# EAGLE design hot_er_lutownica (EAGLE 8.7.0)
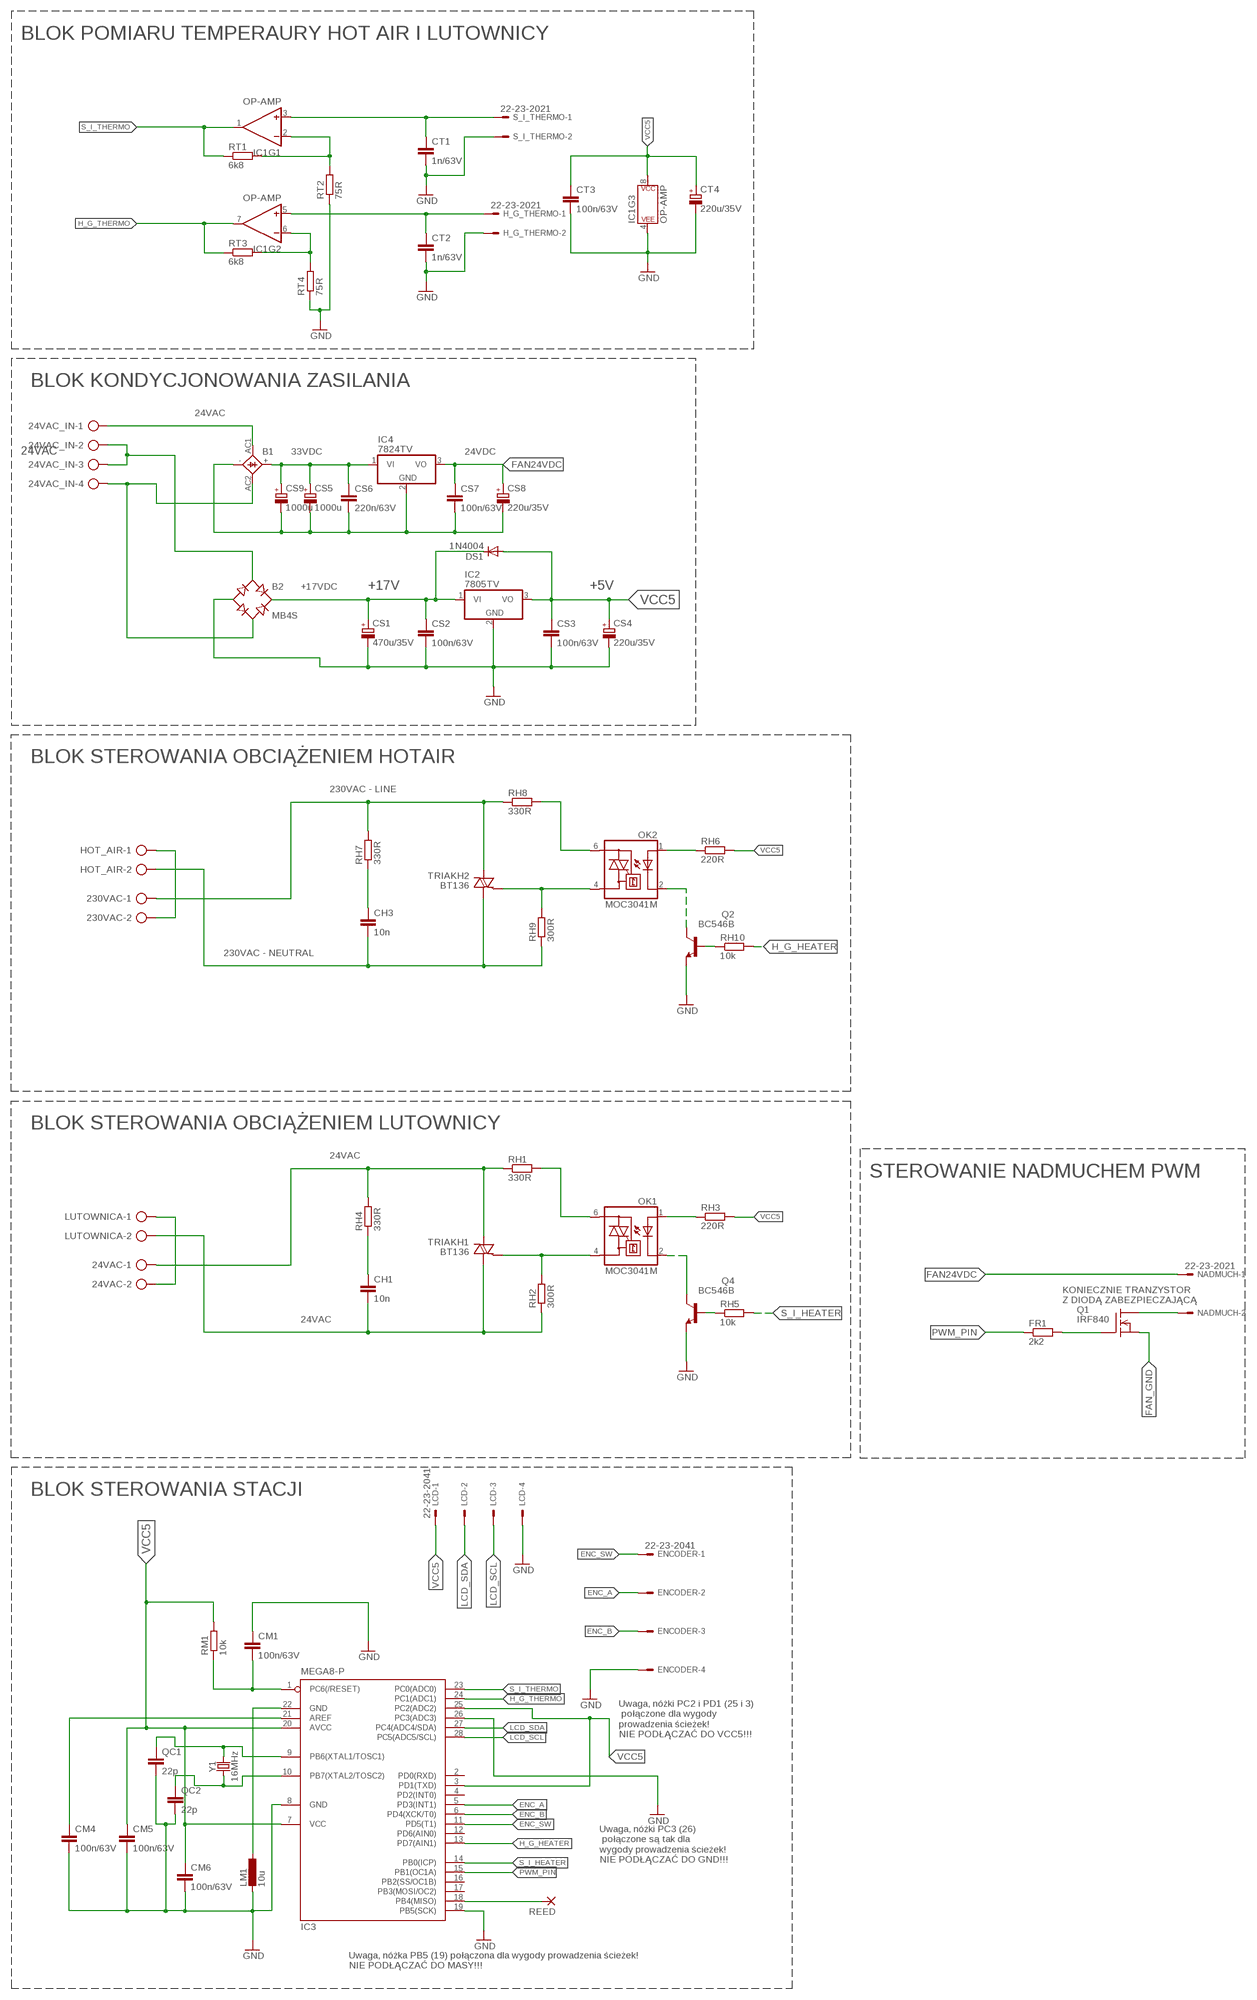
[diagram p0: schematic, sheet 1]

## Parts
24VAC  AK500/2  [AK500/2]
24VAC_IN  AK500/4  [AK500/4]
230VAC  AK500/2  [AK500/2]
B1  2KBB-R  [2KBB-R]
B2  MB4S  [SOIC-4]
CH1  10n  C-EU102-043X133  [C102-043X133]
CH3  10n  C-EU102-043X133  [C102-043X133]
CM1  100n/63V  C-EU050-024X044  [C050-024X044]
CM4  100n/63V  C-EU050-024X044  [C050-024X044]
CM5  100n/63V  C-EU050-024X044  [C050-024X044]
CM6  100n/63V  C-EU050-024X044  [C050-024X044]
CS1  470u/35V  CPOL-EUB45181A  [B45181A]
CS2  100n/63V  C-EU050-024X044  [C050-024X044]
CS3  100n/63V  C-EU050-024X044  [C050-024X044]
CS4  220u/35V  CPOL-EUB45181A  [B45181A]
CS5  1000u  CPOL-EUE3.5-8  [E3,5-8]
CS6  220n/63V  C-EU050-024X044  [C050-024X044]
CS7  100n/63V  C-EU050-024X044  [C050-024X044]
CS8  220u/35V  CPOL-EUB45181A  [B45181A]
CS9  1000u  CPOL-EUE3.5-8  [E3,5-8]
CT1  1n/63V  C-EU050-024X044  [C050-024X044]
CT2  1n/63V  C-EU050-024X044  [C050-024X044]
CT3  100n/63V  C-EU050-024X044  [C050-024X044]
CT4  220u/35V  CPOL-EUB45181B  [B45181B]
DS1  1N4004  [DO41-10]
ENCODER  22-23-2041  [22-23-2041]
FR1  2k2  R-EU_R0805  [R0805]
H_G_THERMO  22-23-2021  [22-23-2021]
HOT_AIR  AK500/2  [AK500/2]
IC1  OP-AMP  OPAMP-DUALDIP  [DIP08]
IC2  7805TV  [TO220V]
IC3  MEGA8-P  [DIL28-3]
IC4  7824TV  [TO220V]
LCD  22-23-2041  [22-23-2041]
LM1  10u  L-EU0207/10  [0207/10]
LUTOWNICA  AK500/2  [AK500/2]
NADMUCH  22-23-2021  [22-23-2021]
OK1  MOC3041M  [DIL06]
OK2  MOC3041M  [DIL06]
Q1  IRF840  [TO220]
Q2  BC546B  [TO92-EBC]
Q4  BC546B  [TO92-EBC]
QC1  22p  C-EUC0805K  [C0805K]
QC2  22p  C-EUC0805K  [C0805K]
REED  2,54/0,9  [2,54/0,9]
RH1  330R  R-EU_0204/7  [0204/7]
RH2  300R  R-EU_0204/5  [0204/5]
RH3  220R  R-EU_0204/5  [0204/5]
RH4  330R  R-EU_0204/5  [0204/5]
RH5  10k  R-EU_0204/7  [0204/7]
RH6  220R  R-EU_0204/7  [0204/7]
RH7  330R  R-EU_0204/7  [0204/7]
RH8  330R  R-EU_0207/10  [0207/10]
RH9  300R  R-EU_0204/5  [0204/5]
RH10  10k  R-EU_0207/12  [0207/12]
RM1  10k  R-EU_R0805  [R0805]
RT1  6k8  R-EU_0207/2V  [0207/2V]
RT2  75R  R-EU_0207/2V  [0207/2V]
RT3  6k8  R-EU_0207/2V  [0207/2V]
RT4  75R  R-EU_0207/2V  [0207/2V]
S_I_THERMO  22-23-2021  [22-23-2021]
TRIAKH1  BT136  [TO220AB]
TRIAKH2  BT136  [TO220AB]
Y1  16MHz  CRYSTALPTH-HC49UV  [HC49U]

## Nets
230NEUTRAL: 230VAC.2 HOT_AIR.1
AGND: IC3.22(GND) LM1.1
COSZEBYBYLODLUGIE: CH3.1 RH7.1
ENC_A: ENCODER.2 IC3.5(PD3(INT1))
ENC_B: ENCODER.3 IC3.6(PD4(XCK/T0))
ENC_SW: ENCODER.1 IC3.11(PD5(T1))
FAN24VDC: CS7.1 CS8.+ IC4.3(VO) NADMUCH.1
FAN_GND: B1.- CS5.- CS6.2 CS7.2 CS8.- CS9.- IC4.2(GND) Q1.3(S)
GATEHOT: OK2.4(A1) RH9.2 TRIAKH2.3(G)
GATELUT: OK1.4(A1) RH2.2 TRIAKH1.3(G)
GND: B2.- CM1.1 CM4.2 CM5.2 CM6.2 CS1.- CS2.2 CS3.2 CS4.- CT1.2 CT2.2 CT3.2 CT4.- ENCODER.4 H_G_THERMO.2 IC1.4(P$V-) IC2.2(GND) IC3.8(GND) IC3.19(PB5(SCK)) IC3.26(PC3(ADC3)) LCD.4 LM1.2 Q2.E Q4.E QC1.2 QC2.2 RT2.1 RT4.1 S_I_THERMO.2
H_G_HEATER: IC3.13(PD7(AIN1)) RH10.2
H_G_THERMO: IC1.7(OUT) IC3.24(PC1(ADC1)) RT3.1
HEATER_L: CH1.2 LUTOWNICA.2 RH2.1 TRIAKH1.1(A1)
HEATER_L1: CH3.2 HOT_AIR.2 RH9.1 TRIAKH2.1(A1)
HG_THERMO: CT2.1 H_G_THERMO.1 IC1.5(+IN)
LCD_SCL: IC3.28(PC5(ADC5/SCL)) LCD.3
LCD_SDA: IC3.27(PC4(ADC4/SDA)) LCD.2
MAIN_L: 24VAC.1 RH1.1 RH4.2 TRIAKH1.2(A2)
MAIN_L1: 230VAC.1 RH7.2 RH8.1 TRIAKH2.2(A2)
MAIN_N: 24VAC.2 LUTOWNICA.1
N$1: IC3.9(PB6(XTAL1/TOSC1)) QC1.1 Y1.2
N$2: IC3.10(PB7(XTAL2/TOSC2)) QC2.1 Y1.1
N$3: OK1.1(A) RH3.1
N$4: OK2.6(A2) RH8.2
N$7: OK2.1(A) RH6.1
N$8: IC1.6(-IN) RT3.2 RT4.2
N$9: NADMUCH.2 Q1.2(D)
N$10: IC1.2(-IN) RT1.2 RT2.2
N$11: 24VAC_IN.1 B1.AC1
N$12: FR1.2 Q1.1(G)
N$13: OK2.2(C) Q2.C
N$15: OK1.6(A2) RH1.2
N$17: Q2.B RH10.1
N$18: 24VAC_IN.2 24VAC_IN.3 B2.~1(AC1)
N$19: 24VAC_IN.4 B1.AC2 B2.~2(AC2)
N$21: OK1.2(C) Q4.C
N$22: Q4.B RH5.1
N$23: CH1.1 RH4.1
POS17V: B2.+ CS1.+ CS2.1 DS1.C IC2.1(VI)
POS33V: B1.+ CS5.+ CS6.1 CS9.+ IC4.1(VI)
PWM_PIN: FR1.1 IC3.15(PB1(OC1A))
REED: IC3.18(PB4(MISO)) REED.1(P)
REFERENCE: CM4.1 IC3.21(AREF)
RESET: CM1.2 IC3.1(PC6(/RESET)) RM1.1
S_I_HEATER: IC3.14(PB0(ICP)) RH5.2
S_I_THERMO: IC1.1(OUT) IC3.23(PC0(ADC0)) RT1.1
SI_THERMO: CT1.1 IC1.3(+IN) S_I_THERMO.1
VCC5: CM5.1 CM6.1 CS3.1 CS4.+ CT3.1 CT4.+ DS1.A IC1.8(P$V+) IC2.3(VO) IC3.3(PD1(TXD)) IC3.7(VCC) IC3.20(AVCC) IC3.25(PC2(ADC2)) LCD.1 RH3.2 RH6.2 RM1.2
Unconnected: IC3.2(PD0(RXD)) IC3.4(PD2(INT0)) IC3.12(PD6(AIN0)) IC3.16(PB2(SS/OC1B)) IC3.17(PB3(MOSI/OC2))

## Notes on the sheet
- BLOK POMIARU TEMPERAURY HOT AIR I LUTOWNICY
- BLOK KONDYCJONOWANIA ZASILANIA
- 24VAC
- 24VAC | 33VDC | 24VDC
- +17VDC | +17V | +5V
- BLOK STEROWANIA OBCIĄŻENIEM HOTAIR
- 230VAC - LINE
- 230VAC - NEUTRAL
- BLOK STEROWANIA OBCIĄŻENIEM LUTOWNICY
- 24VAC
- STEROWANIE NADMUCHEM PWM
- KONIECZNIE TRANZYSTOR
  Z DIODĄ ZABEZPIECZAJĄCĄ
- 24VAC
- BLOK STEROWANIA STACJI
- Uwaga, nóżki PC2 i PD1 (25 i 3)
   połączone dla wygody 
  prowadzenia ścieżek! 
  NIE PODŁĄCZAĆ DO VCC5!!!
- Uwaga, nóżki PC3 (26)
   połączone są tak dla 
  wygody prowadzenia ścieżek! 
  NIE PODŁĄCZAĆ DO GND!!!
- Uwaga, nóżka PB5 (19) połączona dla wygody prowadzenia ścieżek! 
  NIE PODŁĄCZAĆ DO MASY!!!

## Library data of the parts
24VAC 230VAC HOT_AIR LUTOWNICA = con-ptr500:AK500/2: CONNECTOR; OC_FARNELL: unknown; OC_NEWARK: unknown
24VAC_IN = con-ptr500:AK500/4: CONNECTOR; OC_FARNELL: unknown; OC_NEWARK: unknown
B1 = rectifier:2KBB-R: RECTIFIER grid 3 x 5 mm
B2 = rectifier:MB*S: Bridge Rectifier Source: http://www.fairchildsemi.com/ds/MB/MB6S.pdf
CH1 CH3 CM1 CM4-CM6 CS2 CS3 CS6 CS7 CT1-CT3 QC1 QC2 = rcl:C-EU: CAPACITOR, European symbol; SPICEPREFIX: C
CS1 CS4 CS5 CS8 CS9 CT4 = rcl:CPOL-EU: POLARIZED CAPACITOR, European symbol; SPICEPREFIX: C
DS1 = diode:1N4004: DIODE general purpose rectifier, 1 A
ENCODER LCD = con-molex:22-23-2041: .100" (2.54mm) Center Header - 4 Pin; MF: MOLEX; MPN: 22-23-2041; OC_FARNELL: 1462920; OC_NEWARK: 38C0355
FR1 RH1-RH10 RM1 RT1-RT4 = rcl:R-EU_: RESISTOR, European symbol; SPICEPREFIX: R
H_G_THERMO NADMUCH S_I_THERMO = con-molex:22-23-2021: .100" (2.54mm) Center Header - 2 Pin; MF: MOLEX; MPN: 22-23-2021; OC_FARNELL: 1462926; OC_NEWARK: 25C3832
IC1 = SparkFun-IC-Amplifiers:OPAMP-DUAL: Generic op-amp footprint This component is for the standard 358 pinning of a dual op-amp From the LM358 datasheet: Pin 1: Output A Pin 2: Inverting Input A Pin 3: Non-Inverting Input A Pin 4: Gnd Pin 5: Non-Inverting Input B Pin 6: Inverting Input B Pin 7: Output B Pin 8: V+; PROD_ID: NA-XXXXX
IC2 IC4 = linear:78*: Positive VOLTAGE REGULATOR Source: http://cache.national.com/ds/LM/LM78L05.pdf http://www.fairchildsemi.com/ds/LM/LM7805.pdf
IC3 = atmel:MEGA8-P: MICROCONTROLLER 8 Kbytes FLASH, 1 kbytes SRAM, 512 bytes EEPROM, USART, 4-channel 10 bit ADC, 2-channel 8 bit ADC Pin compatible with Atmega48, ATMega88, ATMega168 Source: avr.lbr; OC_FARNELL: unknown; OC_NEWARK: unknown
LM1 = rcl:L-EU: INDUCTOR, European symbol; SPICEPREFIX: L
OK1 OK2 = optocoupler:MOC30*: 6-Pin DIP Zero-Cross Optoisolators Triac Driver Output (250/400 Volt Peak) Source: Data sheet <http://www.fairchildsemi.com/ds/MO/MOC3031M.pdf> The old path of data sheet not more available 2013-05-06.; MF: FAIRCHILD SEMICONDUCTOR; MPN: MOC3041M; OC_FARNELL: 1086677; OC_NEWARK: 78K6090
Q1 = transistor-fet:IRF840: N-Channel Enhancement MOSFET (HEXFET); 500V; 8A; 0,85Ohm
Q2 Q4 = transistor-npn:BC546*: NPN Transistor
REED = wirepad:2,54/0,9: THROUGH-HOLE PAD
TRIAKH1 TRIAKH2 = triac:BT136: Triac BT136 series E sensitive gate Source: http://www.nxp.com/acrobat_download/datasheets/BT136_SERIES_E_2.pdf
Y1 = SparkFun-Clocks:CRYSTAL: Crystals (Generic) These are passive quartz crystals, which can be used as a clock source for a microcontroller. Crystal's are two-terminal devices. They require external "load" capacitors to generate an oscillating signal.

## Board
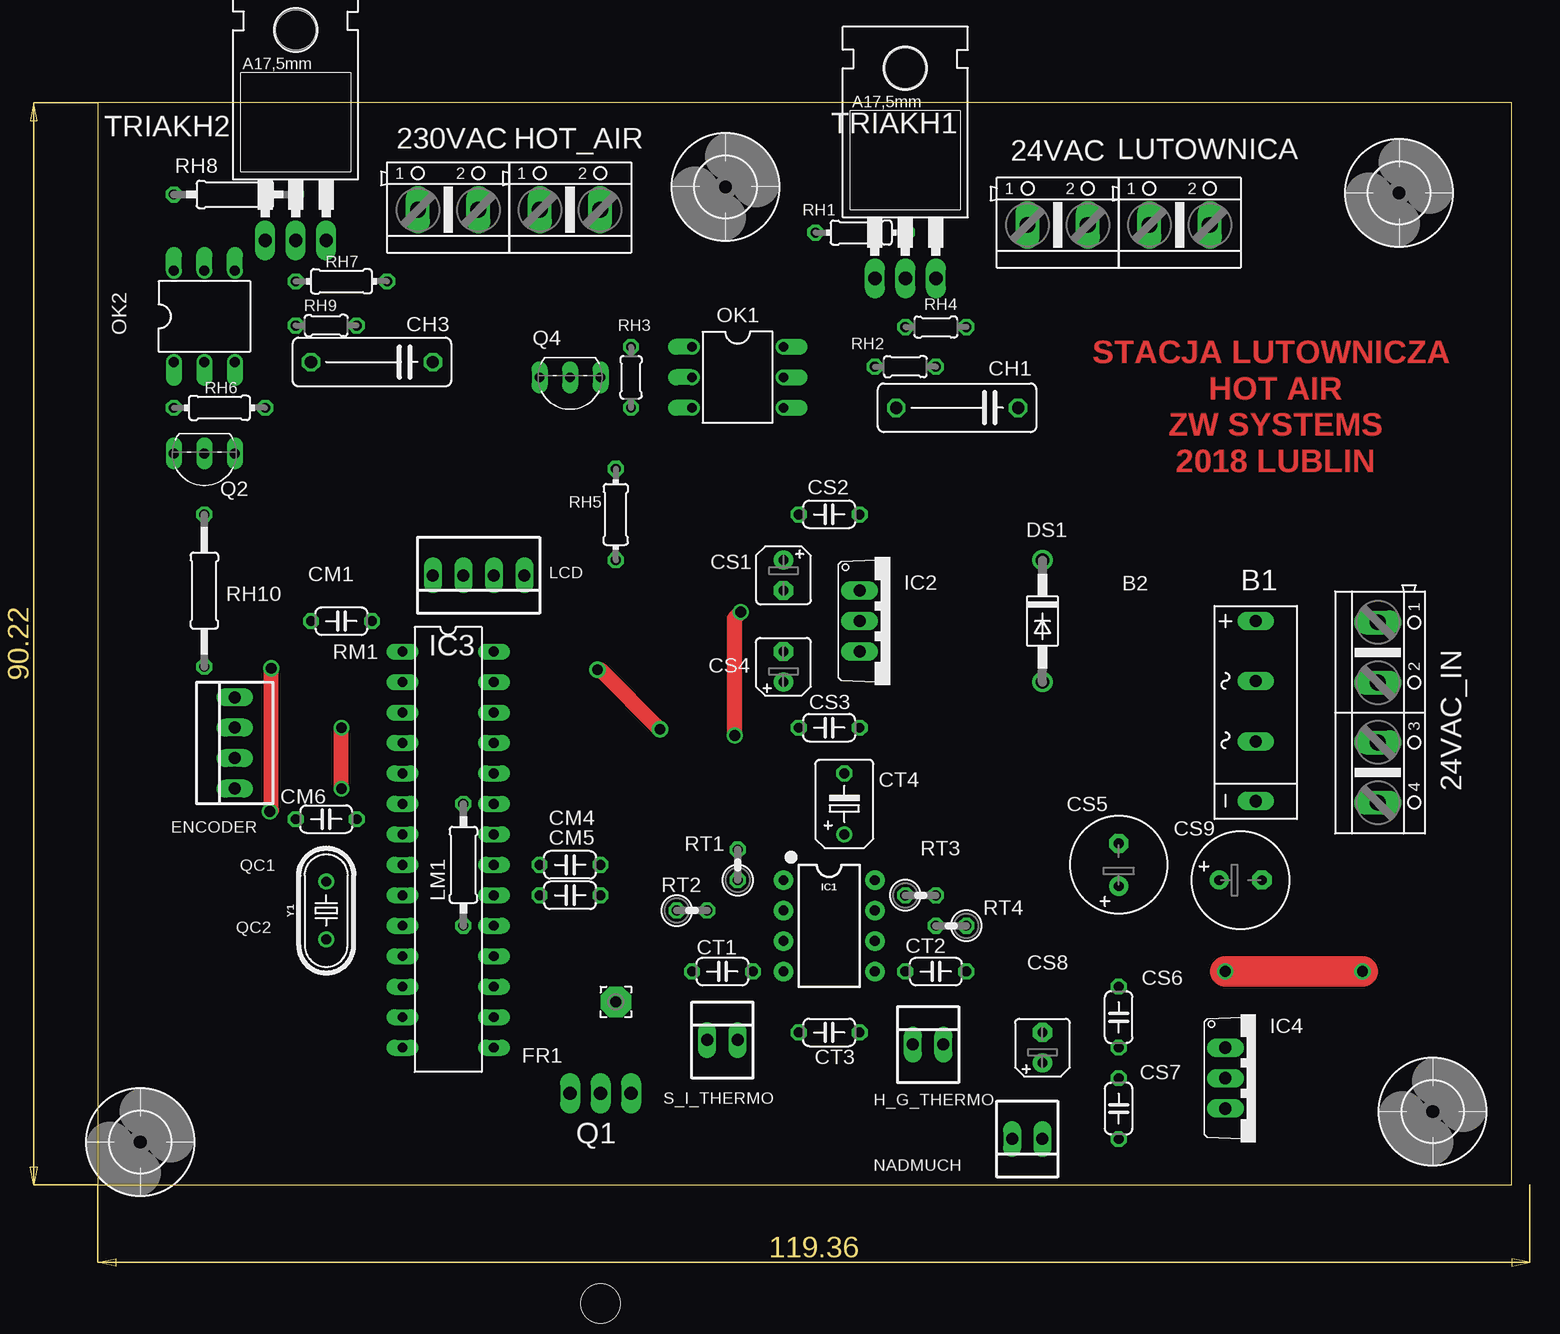
[diagram p1: board, top side]
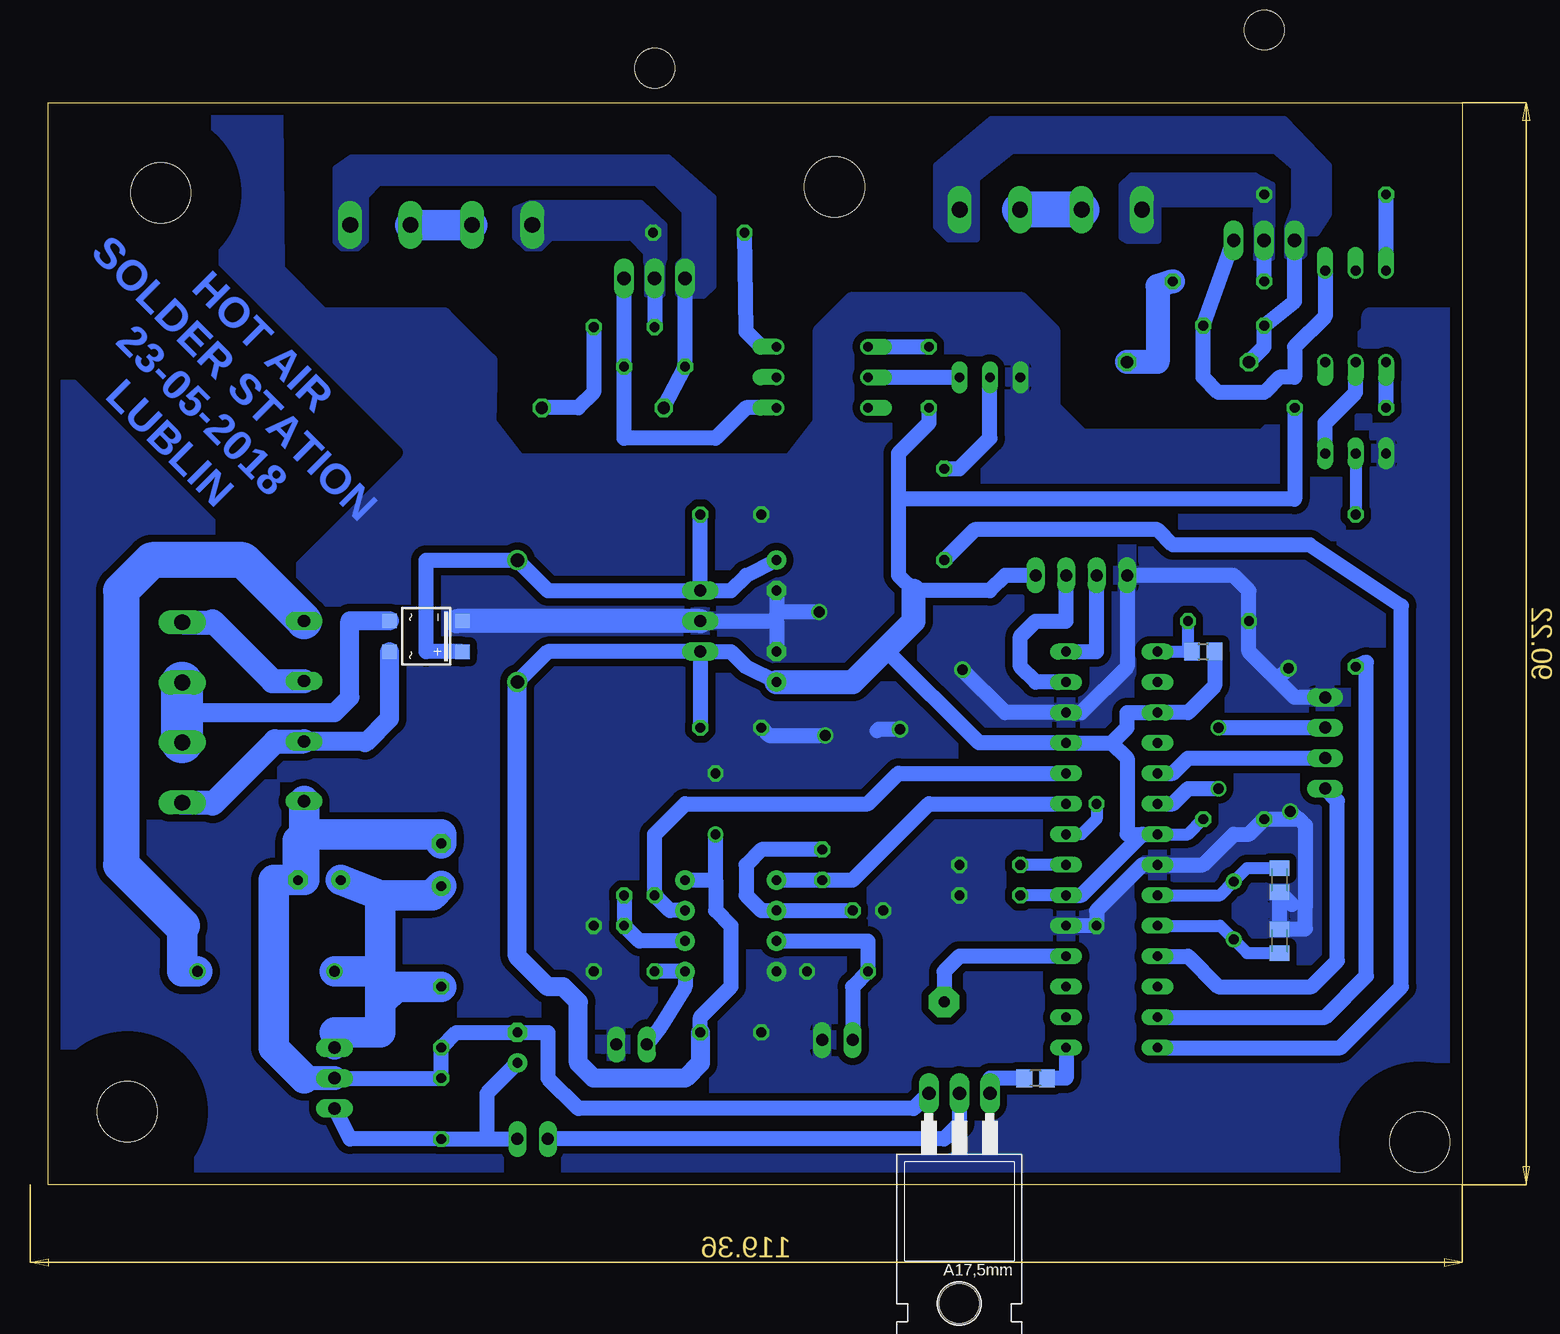
[diagram p2: board, bottom side, seen from below]

Size 117.84 x 90.22 mm. Coordinates in mm from the lower left corner, seen from the top.
Outline: 0,0 117.84,0 117.84,90.22 0,90.22 0,0
Copper layers (1*16): Top 0.035mm / dielectric 1.5mm / Bottom 0.035mm
Design rules "default": minimum track width 6mil, minimum drill 0.35mm, track to track 6mil, track to pad 6mil, pad to pad 6mil, via to via 6mil, smd to smd 6mil, copper to edge 40mil, drill to drill 6mil, minimum pad ring 10mil, minimum via ring 8mil, stop-mask expansion 4mil, vias tented up to drill 0mil, thermal gap 10mil

### Footprints (pad centres in the part's own frame; a part is rotated, then mirrored left to right if it is on the bottom)
AK500/2 = drill 1.321 long: 1 -2.515,0; 2 2.515,0
AK500/4 = drill 1.321 long: 1 -7.518,0; 2 -2.489,0; 3 2.489,0; 4 7.518,0
2KBB-R = drill 1.016 long: + -7.62,0; - 7.391,0; AC1 -2.616,0; AC2 2.413,0
SOIC-4 = smd 1.2 x 1.2: + 1.3,3.05; - -1.3,3.05; ~1 -1.3,-3.05; ~2 1.3,-3.05
C102-043X133 = drill 1.016 octagon: 1 -5.08,0; 2 5.08,0
C050-024X044 = drill 0.813 octagon: 1 -2.54,0; 2 2.54,0
B45181A = drill 0.813 pad 1.6: + -1.27,0 | drill 0.813 pad 1.6 octagon: - 1.27,0
E3,5-8 = drill 0.813 pad 1.6: + -1.778,0 | drill 0.813 pad 1.6 octagon: - 1.778,0
B45181B = drill 0.813: + -2.54,0 | drill 0.813 octagon: - 2.54,0
DO41-10 = drill 1.118: A 5.08,0; C -5.08,0
22-23-2041 = drill 1 long: 1 -3.81,0; 2 -1.27,0; 3 1.27,0; 4 3.81,0
R0805 = smd 1.3 x 1.5: 1 -0.95,0; 2 0.95,0
22-23-2021 = drill 1 long: 1 -1.27,0; 2 1.27,0
DIP08 = drill 0.813 pad 1.626: 1 -3.81,-3.81; 2 -1.27,-3.81; 3 1.27,-3.81; 4 3.81,-3.81; 5 3.81,3.81; 6 1.27,3.81; 7 -1.27,3.81; 8 -3.81,3.81
TO220V = drill 1.016 long: 1 -2.54,-2.54; 2 0,-2.54; 3 2.54,-2.54
DIL28-3 = drill 0.813 long: 1 -16.51,-3.81; 2 -13.97,-3.81; 3 -11.43,-3.81; 4 -8.89,-3.81; 5 -6.35,-3.81; 6 -3.81,-3.81; 7 -1.27,-3.81; 8 1.27,-3.81; 9 3.81,-3.81; 10 6.35,-3.81; 11 8.89,-3.81; 12 11.43,-3.81; 13 13.97,-3.81; 14 16.51,-3.81; 15 16.51,3.81; 16 13.97,3.81; 17 11.43,3.81; 18 8.89,3.81; 19 6.35,3.81; 20 3.81,3.81; 21 1.27,3.81; 22 -1.27,3.81; 23 -3.81,3.81; 24 -6.35,3.81; 25 -8.89,3.81; 26 -11.43,3.81; 27 -13.97,3.81; 28 -16.51,3.81
0207/10 = drill 0.813 octagon: 1 -5.08,0; 2 5.08,0
DIL06 = drill 0.813 offset: 1 -2.54,-3.81; 2 0,-3.81; 3 2.54,-3.81; 4 2.54,3.81; 5 0,3.81; 6 -2.54,3.81
TO220 = drill 1.118 long: 1 -2.54,-6.35; 2 0,-6.35; 3 2.54,-6.35 | hole 3.302: 0,11.176
TO92-EBC = drill 0.813 long: B 0,-1.27; C -2.54,-1.27; E 2.54,-1.27
C0805K = smd 1.3 x 1.6: 1 -1,0; 2 1,0
2,54/0,9 = drill 0.914 pad 2.54 octagon: 1 0,0
0204/7 = drill 0.813 octagon: 1 -3.81,0; 2 3.81,0
0204/5 = drill 0.813 octagon: 1 -2.54,0; 2 2.54,0
0207/12 = drill 0.813 octagon: 1 -6.35,0; 2 6.35,0
0207/2V = drill 0.813 octagon: 1 -1.27,0; 2 1.27,0
TO220AB = drill 1.118 long: 1 -2.54,-6.35; 2 0,-6.35; 3 2.54,-6.35 | hole 3.302: 0,11.176
5,0 = hole 5: 0,0
HC49U = drill 0.813: 1 -2.413,0; 2 2.413,0

### Placement (x,y rotation side)
24VAC  80.01,80.01 0 top
24VAC_IN  106.68,39.37 270 top
230VAC  29.21,81.28 0 top
B1  96.52,39.37 270 top
B2  86.36,45.72 270 bottom
CH1  71.63,64.77 180 top
CH3  22.86,68.58 180 top
CM1  20.32,46.99 0 top
CM4  39.37,26.67 0 top
CM5  39.37,24.13 0 top
CM6  19.05,30.48 180 top
CS1  57.15,50.8 270 top
CS2  60.96,55.88 180 top
CS3  60.96,38.1 180 top
CS4  57.15,43.18 90 top
CS5  85.09,26.67 90 top
CS6  85.09,13.97 270 top
CS7  85.09,6.35 90 top
CS8  78.74,11.43 90 top
CS9  95.25,25.4 0 top
CT1  52.07,17.78 0 top
CT2  69.85,17.78 0 top
CT3  60.96,12.7 180 top
CT4  62.23,31.75 90 top
DS1  78.74,46.99 270 top
ENCODER  11.43,36.83 90 top
FR1  35.56,8.89 180 bottom
H_G_THERMO  69.22,11.68 0 top
HOT_AIR  39.37,81.28 0 top
IC1  60.96,21.59 270 top
IC2  66.04,46.99 270 top
IC3  29.21,27.94 270 top
IC4  96.52,8.89 270 top
LCD  31.75,50.8 180 top
LM1  30.48,26.67 270 top
LUTOWNICA  90.17,80.01 0 top
NADMUCH  77.47,3.81 180 top
OK1  53.34,67.31 270 top
OK2  8.89,72.39 0 top
Q1  41.91,1.27 180 bottom
Q2  8.89,59.69 180 top
Q4  39.37,66.04 180 top
QC1  15.24,25.4 270 bottom
QC2  15.24,20.32 90 bottom
REED  43.18,15.24 0 top
RH1  63.63,79.38 180 top
RH2  67.31,68.2 0 top
RH3  44.45,67.31 270 top
RH4  69.85,71.5 180 top
RH5  43.18,55.88 270 top
RH6  10.16,64.77 0 top
RH7  20.32,75.31 180 top
RH8  11.43,82.55 180 top
RH9  19.05,71.63 0 top
RH10  8.89,49.53 270 top
RM1  21.59,44.45 0 bottom
RT1  53.34,26.67 90 top
RT2  49.53,22.86 0 top
RT3  68.58,24.13 0 top
RT4  71.12,21.59 180 top
S_I_THERMO  52.07,12.06 0 top
TRIAKH1  67.31,81.92 0 top
TRIAKH2  16.51,85.09 0 top
U$1  [5,0]  108.46,82.68 0 top
U$2  [5,0]  111.25,6.1 0 top
U$3  [5,0]  3.56,3.56 0 top
U$4  [5,0]  52.32,83.19 0 top
Y1  19.05,22.86 90 top

### Tracks (layer width: path | path; a pad name or v marks a point on that pad's centre or on a via)
230NEUTRAL
  Bottom 3: 230VAC.2 HOT_AIR.1
AGND
  Bottom 1.016: LM1.1 30.48,30.48 31.75,29.21 IC3.22
COSZEBYBYLODLUGIE
  Bottom 2: RH7.1 25.4,74.93 25.4,68.58 CH3.1
ENC_A
  Bottom 1.27: IC3.5 24.13,34.29 22.86,35.56 ENCODER.2
ENC_B  (via drill 0.85 pad 1)
  Top 1.27: v20.32,33.02 v20.32,38.1
  Bottom 1.27: IC3.6 24.13,31.75 22.86,33.02 v20.32,33.02 | v20.32,38.1 ENCODER.3
ENC_SW
  Bottom 1.27: IC3.11 22.86,19.05 20.32,16.51 12.57,16.51 10.41,18.67 10.41,32 ENCODER.1
FAN24VDC
  Bottom 1.27: 81.28,3.81 CS7.1 92.71,3.81 IC4.3 | 81.28,3.81 NADMUCH.1 | CS8.+ 81.28,7.62 81.28,3.81
FAN_GND
  Bottom 1.27: Q1.3 45.72,6.35 73.66,6.35 76.2,8.89 76.2,12.7 CS8.- 83.82,12.7 CS6.2 CS7.2 IC4.2
  Bottom 2: 95.25,8.89 IC4.2 96.52,8.89
  Bottom 2.54: B1.- 96.52,25.4 CS9.- | CS9.- 99.06,25.4 99.06,11.43 96.52,8.89 | CS9.- 97.03,28.7 96.52,29.21 85.09,29.21 CS5.-
GATEHOT
  Bottom 1.27: TRIAKH2.3 RH9.2 21.59,67.31 20.32,66.04 16.51,66.04 15.24,67.31 13.97,67.31 13.97,69.85 11.43,72.39 OK2.4
GATELUT
  Bottom 1.27: OK1.4 59.69,64.77 62.23,62.23 69.85,62.23 RH2.2 TRIAKH1.3
GND  (via drill 0.9 pad 1.2)
  Top 1.27: v41.66,42.93 41.91,42.93 v46.86,37.97 | v14.35,31.11 14.48,31.24 v14.48,43.05 | v53.09,37.47 53.09,47.24 v53.59,47.75
  Bottom 1.27: IC3.19 LM1.2 30.48,22.86 26.67,26.67 IC3.8 21.59,26.67 19.05,29.21 17.78,29.21 CM6.2 13.72,30.48 | ENCODER.4 13.97,40.64 15.37,42.04 | 15.37,42.04 17.78,44.45 CM1.1 17.78,49.53 19.05,50.8 LCD.4 27.94,43.18 31.75,39.37 IC3.26 38.1,39.37 v41.66,42.93 | IC2.2 57.15,46.99 | 57.15,46.99 57.15,47.5 | CS1.- 57.15,47.5 | 57.15,46.99 CS4.- | 14.21,23.37 QC1.2 QC2.2 13.1,21.32 13.08,21.34 13.08,23.24 | 13.21,23.37 13.08,23.24 | 13.08,23.24 13.08,29.97 13.59,30.48 13.72,30.48 | v46.86,37.97 48.64,37.97 48.77,37.85 | 13.72,30.48 v14.35,31.11 | v14.48,43.05 15.37,42.16 15.37,42.04 | CS3.2 57.79,37.47 v53.09,37.47 | v53.59,47.75 56.9,47.75 57.15,47.5
  Bottom 2: IC2.2 83.82,46.99
  pour Bottom (isolate 0.61): 0,0 117.86,-0.25 117.86,89.15 99.06,89.41 98.93,76.2 95.12,72.39 84.96,72.39 81.15,68.58 81.28,63.5 78.74,60.2 55.88,60.2 53.34,63.5 53.34,71.12 50.8,73.66 36.83,73.66 34.29,71.12 34.29,64.77 31.75,62.23 16.51,62.23 7.62,71.12 7.62,72.39 0,72.39
H_G_HEATER
  Bottom 1.27: RH10.2 8,43.56 8,17.4 11.43,13.97 IC3.13
H_G_THERMO
  Bottom 1.27: IC1.7 66.04,22.86 RT3.1 67.31,29.21 64.77,31.75 49.53,31.75 46.99,34.29 IC3.24
HEATER_L
  Bottom 1.27: CH1.2 RH2.1 TRIAKH1.1
  pour Bottom (isolate 0.813, no thermals): 65.28,74.3 65.28,76.71 64.77,77.22 64.77,81.15 67.18,83.57 90.3,83.57 91.44,82.42 91.44,78.74 92.08,78.11 93.34,78.11 93.85,78.61 93.85,84.71 92.58,85.6 66.17,85.6 62.48,82.3 62.48,74.93 63.25,74.17 65.15,74.17
HEATER_L1
  Bottom 1.27: CH3.2 16.51,69.85 RH9.1 13.97,73.66 TRIAKH2.1
  pour Bottom (isolate 0.813, no thermals): 14.61,77.47 14.61,79.76 13.97,81.41 13.97,84.84 15.62,86.23 37.47,86.23 40.51,83.82 40.51,78.87 42.8,78.87 43.81,79.88 43.81,84.96 39.24,88.77 14.86,88.77 11.18,84.96 11.18,80.9 12.19,79.38 13.21,79.38 13.21,77.6 13.34,77.47
HG_THERMO
  Bottom 1.27: CT2.1 IC1.5 64.77,16.51 66.8,13.21 H_G_THERMO.1
LCD_SCL
  Bottom 1.27: IC3.28 30.48,44.45 LCD.3
LCD_SDA
  Bottom 1.27: IC3.27 35.56,41.91 36.83,43.18 36.83,45.72 35.56,46.99 33.02,46.99 LCD.2
MAIN_L
  Bottom 1.27: TRIAKH1.2 RH4.2
  pour Bottom (isolate 0.813, no thermals): 67.94,74.3 67.94,77.72 69.22,78.99 75.95,78.99 76.83,78.11 77.98,78.11 78.87,78.99 78.87,81.28 77.6,81.79 68.45,81.79 66.55,80.01 66.55,74.42 66.8,74.17 67.69,74.17 67.82,74.3
MAIN_L1
  Bottom 1.27: RH7.2 TRIAKH2.2
  pour Bottom (isolate 0.813, no thermals): 27.94,78.74 25.4,78.74 25.4,81.79 17.15,81.79 17.27,77.34 15.88,77.34 15.88,83.31 17.27,84.07 27.56,84.07 28.32,83.31 28.32,78.99
MAIN_N
  Bottom 2.54: 24VAC.2 LUTOWNICA.1
N$1
  Bottom 1.016: IC3.9 20.19,24.13 Y1.2 17.92,26.4 QC1.1
N$2
  Bottom 1.016: IC3.10 20.19,21.59 Y1.1 17.92,19.32 QC2.1
N$3
  Bottom 1.27: OK1.1 RH3.1
N$4
  Bottom 1.27: OK2.6 RH8.2
N$7
  Bottom 1.27: RH6.1 OK2.1
N$8
  Bottom 1.27: IC1.6 68.58,20.32 RT4.2 RT3.2
N$9
  Bottom 1.27: Q1.2 41.91,5.08 43.18,3.81 NADMUCH.2
N$10
  Bottom 1.27: RT2.2 IC1.2 58.42,22.86 59.69,24.13 59.69,26.67 58.42,27.94 RT1.2
N$11
  Bottom 2: 24VAC_IN.1 104.24,46.89 104.14,46.99 99.14,41.99 B1.AC1
N$12
  Bottom 1.27: FR1.2 39.37,8.89 Q1.1
N$13
  Bottom 1.27: Q2.C 11.43,63.5 8.89,66.04 OK2.2
N$15
  Bottom 1.27: OK1.6 58.42,69.85 59.69,71.12 RH1.2
N$17
  Bottom 1.016: Q2.B RH10.1
N$18
  Bottom 1.6: 106.68,39.37 93.98,39.37 92.71,40.64 92.71,46.99 92.68,47.02 B2.~1
  Bottom 3.5: 24VAC_IN.3 106.68,39.37 24VAC_IN.2
N$19
  Bottom 1.6: B2.~2 89.41,38.86 91.44,36.83 91.57,36.96 B1.AC2
  Bottom 2: 24VAC_IN.4 104.24,31.85 104.14,31.75 98.93,36.96 B1.AC2
N$21
  Bottom 1.27: OK1.2 Q4.C
N$22
  Bottom 1.27: RH5.1 41.91,59.69 39.37,62.23 Q4.B
N$23
  Bottom 1.27: RH4.1 72.39,66.04 73.66,64.77 CH1.1
POS17V
  Bottom 1.27: IC2.1 60.96,49.53 59.69,50.8 CS1.+ | IC2.1 CS2.1 | IC2.1 76.2,49.53 DS1.C 86.36,52.07 86.36,44.45 83.34,44.45 B2.+
POS33V  (via drill 0.9 pad 1.2)
  Top 2.54: v105.41,17.78 v93.98,17.78
  Bottom 2: 93.98,12.7 IC4.1
  Bottom 2.54: 90.17,24.13 CS9.+ | 90.17,24.13 85.85,24.13 CS5.+ | 90.17,15.24 90.17,12.7 93.98,12.7 | 90.17,15.24 90.17,17.78 | 90.17,17.78 90.17,24.13 | CS6.1 88.9,16.51 90.17,15.24 | 106.68,21.59 106.68,17.78 v105.41,17.78 | v93.98,17.78 90.17,17.78
  Bottom 3: B1.+ 101.6,52.07 109.22,52.07 111.76,49.53 111.76,26.67 106.68,21.59
PWM_PIN
  Bottom 1.27: IC3.15 33.02,8.89 FR1.1
REED
  Bottom 1.27: IC3.18 41.91,19.05 43.18,17.78 REED.1
REFERENCE
  Bottom 1.016: IC3.21 CM4.1
RESET
  Bottom 1.016: IC3.1 RM1.1 22.86,44.77 CM1.2
S_I_HEATER
  Bottom 1.27: IC3.14 10.16,11.43 5.08,16.51 5.08,48.26 12.7,53.34 24.13,53.34 25.4,54.61 40.64,54.61 RH5.2
S_I_THERMO
  Bottom 1.27: IC1.1 RT1.1 50.8,25.4 44.45,31.75 IC3.23
SI_THERMO
  Bottom 1.27: IC1.3 49.53,20.32 CT1.1 50.8,16.51 S_I_THERMO.1
VCC5
  Bottom 1.016: IC3.7 22.86,29.21 CM6.1 | IC3.20 CM5.1
  Bottom 1.27: 62.23,25.4 CT4.+ | CT3.1 63.5,13.97 60.96,16.51 60.96,21.59 62.23,22.86 62.23,25.4 | IC1.8 62.23,25.4 | IC3.20 31.75,24.13 26.67,29.21 IC3.7 27.94,29.21 27.94,35.56 29.21,36.83 | 29.21,36.83 IC3.25 40.26,36.83 48.07,44.64 | 29.21,36.83 27.94,38.1 27.94,39.37 IC3.3 22.86,39.37 20.64,41.59 RM1.2 | LCD.1 38.1,50.8 39.37,49.53 45.72,49.53 46.99,50.8 46.99,57.15 | RH6.2 13.97,57.15 46.99,57.15 | RH3.2 44.45,63.5 46.99,60.96 46.99,57.15 | IC2.3 60.96,44.45 59.69,43.18 CS4.+ | IC2.3 76.2,44.45 DS1.A | IC2.3 CS3.1
  Bottom 1.6: CT3.1 63.5,10.16 64.77,8.89 72.39,8.89 73.66,10.16 73.66,15.24 74.93,16.51 76.2,16.51 78.74,19.05 DS1.A
  Bottom 2: CS4.+ 50.8,41.91 48.07,44.64 45.72,46.99 45.72,49.53

### Text on the board
Top: STACJA LUTOWNICZA / HOT AIR / ZW SYSTEMS / 2018 LUBLIN
Bottom: HOT AIR / SOLDER STATION / 23-05-2018 / LUBLIN
tValues: GND | SCL | SDA | VCC5 | GND | ENC_B | ENC_A | SW | REED | 220u / 50V | 220n / 63V | SENSE | GND | S_I | H_G | GND | 100n / 63V | GND | VCC24